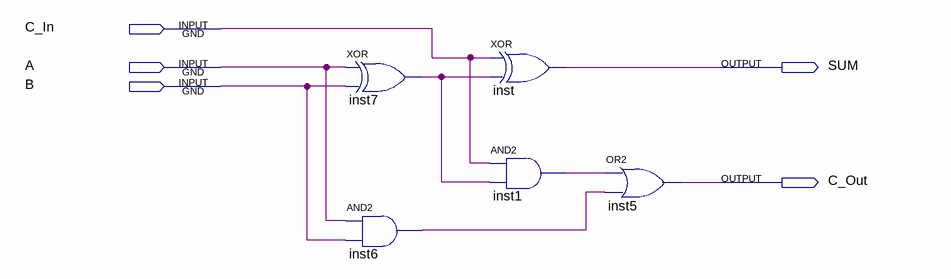
[diagram p0: schematic sheet]
// Quartus schematic Adder.bdf as structural Verilog: 5 symbols, 5 pins
module Adder (
  input  C_In,
  input  A,
  input  B,
  output SUM,
  output C_Out
);

  wire inst1_out, inst6_out, inst7_out;

  xor inst7 (inst7_out, A, B);
  and inst6 (inst6_out, A, B);
  xor inst (SUM, C_In, inst7_out);
  and inst1 (inst1_out, C_In, inst7_out);
  or inst5 (C_Out, inst1_out, inst6_out);
endmodule
